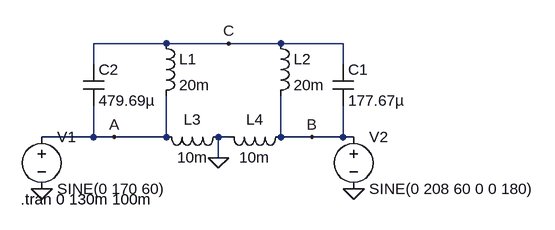
[diagram p0: schematic Spice_Model.asc]
Spice_Model.asc, the LTspice schematic file:
Version 4
SHEET 1 880 680
WIRE 96 32 -16 32
WIRE 192 32 96 32
WIRE 272 32 192 32
WIRE 368 32 272 32
WIRE -16 64 -16 32
WIRE 368 64 368 32
WIRE -16 176 -16 128
WIRE -16 176 -96 176
WIRE 16 176 -16 176
WIRE 96 176 96 112
WIRE 96 176 16 176
WIRE 192 176 176 176
WIRE 272 176 272 112
WIRE 320 176 272 176
WIRE 368 176 368 128
WIRE 368 176 320 176
WIRE 384 176 368 176
WIRE 176 208 176 176
FLAG 176 208 0
FLAG -96 256 0
FLAG 384 256 0
FLAG 16 176 A
FLAG 320 176 B
FLAG 192 32 C
SYMBOL ind 80 16 R0
SYMATTR InstName L1
SYMATTR Value 20m
SYMATTR SpiceLine Rser=2
SYMBOL ind 256 16 R0
SYMATTR InstName L2
SYMATTR Value 20m
SYMATTR SpiceLine Rser=2
SYMBOL ind 192 160 R90
WINDOW 0 5 56 VBottom 2
WINDOW 3 32 56 VTop 2
SYMATTR InstName L3
SYMATTR Value 10m
SYMATTR SpiceLine Rser=1
SYMBOL ind 288 160 R90
WINDOW 0 5 56 VBottom 2
WINDOW 3 32 56 VTop 2
SYMATTR InstName L4
SYMATTR Value 10m
SYMATTR SpiceLine Rser=1
SYMBOL voltage -96 160 R0
WINDOW 123 0 0 Left 0
WINDOW 39 0 0 Left 0
SYMATTR InstName V1
SYMATTR Value SINE(0 170 60)
SYMBOL voltage 384 160 R0
WINDOW 123 0 0 Left 0
WINDOW 39 0 0 Left 0
SYMATTR InstName V2
SYMATTR Value SINE(0 208 60 0 0 180)
SYMBOL cap 352 64 R0
SYMATTR InstName C1
SYMATTR Value 177.67µ
SYMBOL cap -32 64 R0
SYMATTR InstName C2
SYMATTR Value 479.69µ
TEXT -128 272 Left 2 !.tran 0 130m 100m

The netlist it stands for:
* Spice_Model.asc
L1 C A 20m Rser=2
L2 C B 20m Rser=2
L3 0 A 10m Rser=1
L4 B 0 10m Rser=1
V1 A 0 SINE(0 170 60)
V2 B 0 SINE(0 208 60 0 0 180)
C1 C B 177.67µ
C2 C A 479.69µ
.tran 0 130m 100m
.backanno
.end